# Altium project Card_reader.PrjPcb
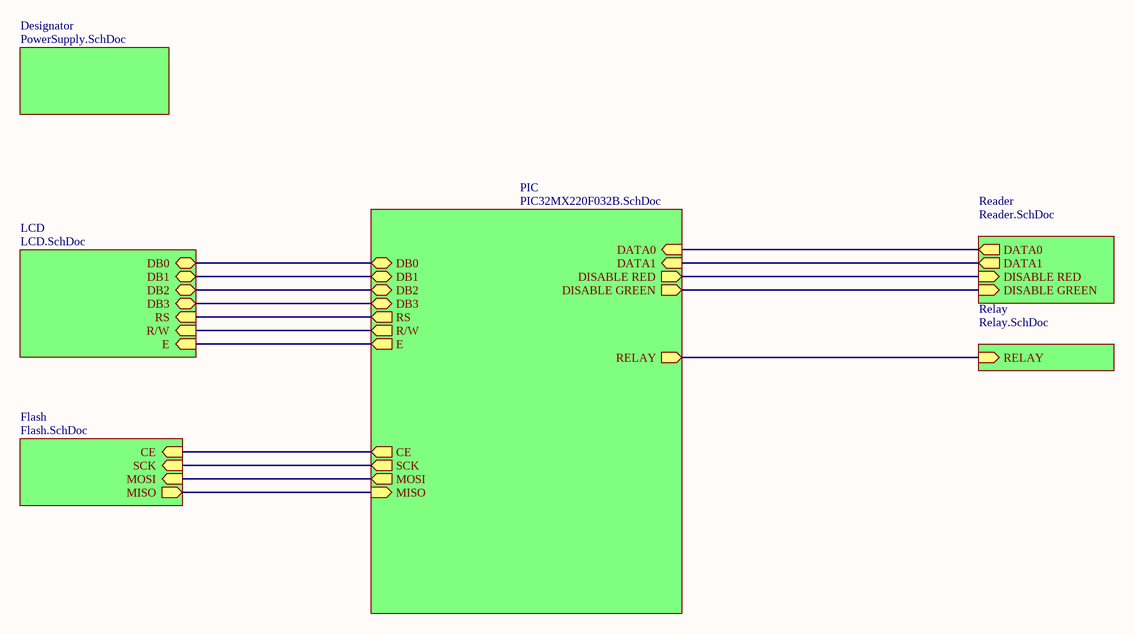
[diagram p0: Card_reader.SchDoc]
7 sheets, 36 parts. Net scope: hierarchical (ports join the sheet entries above them; power ports are global).
Board file: Card_reader2.PcbDoc
Sheets:
  Card_reader.SchDoc
    Designator = PowerSupply.SchDoc
    PIC = PIC32MX220F032B.SchDoc
    Reader = Reader.SchDoc
    Relay = Relay.SchDoc
    LCD = LCD.SchDoc
    Flash = Flash.SchDoc

## Sheet Card_reader.SchDoc
size A4

### Sub-sheets
Designator = PowerSupply.SchDoc: no entries
Flash = Flash.SchDoc: CE (in), SCK (in), MOSI (in), MISO (out)
LCD = LCD.SchDoc: DB0 (bidir), DB1 (bidir), DB2 (bidir), DB3 (bidir), RS (in), R/W (in), E (in)
PIC = PIC32MX220F032B.SchDoc: DATA0 (in), RELAY (out), DB0 (bidir), DATA1 (in), DISABLE RED (out), DISABLE GREEN (out), DB1 (bidir), DB2 (bidir), DB3 (bidir), RS (out), R/W (out), E (out), CE (out), SCK (out), MOSI (out), MISO (in)
Reader = Reader.SchDoc: DATA0 (out), DATA1 (out), DISABLE RED (in), DISABLE GREEN (in)
Relay = Relay.SchDoc: RELAY (in)

### Nets
CE: sheet PIC/CE, sheet Flash/CE
DB0: sheet PIC/DB0, sheet LCD/DB0
DB1: sheet PIC/DB1, sheet LCD/DB1
DB2: sheet PIC/DB2, sheet LCD/DB2
DB3: sheet PIC/DB3, sheet LCD/DB3
DISABLE GREEN: sheet PIC/DISABLE GREEN, sheet Reader/DISABLE GREEN
DISABLE RED: sheet PIC/DISABLE RED, sheet Reader/DISABLE RED
E: sheet PIC/E, sheet LCD/E
MISO: sheet PIC/MISO, sheet Flash/MISO
MOSI: sheet PIC/MOSI, sheet Flash/MOSI
R/W: sheet PIC/R/W, sheet LCD/R/W
RELAY: sheet PIC/RELAY, sheet Relay/RELAY
RS: sheet PIC/RS, sheet LCD/RS
SCK: sheet PIC/SCK, sheet Flash/SCK
NetR5_1: sheet PIC/DATA0, sheet Reader/DATA0
NetR7_1: sheet PIC/DATA1, sheet Reader/DATA1

### Notes on the sheet
- Title
- Size:
- Date:
- A4
- Number:
- Time:
- Revision:
- Sheet
- of
- File:

## Sheet PowerSupply.SchDoc
size A4
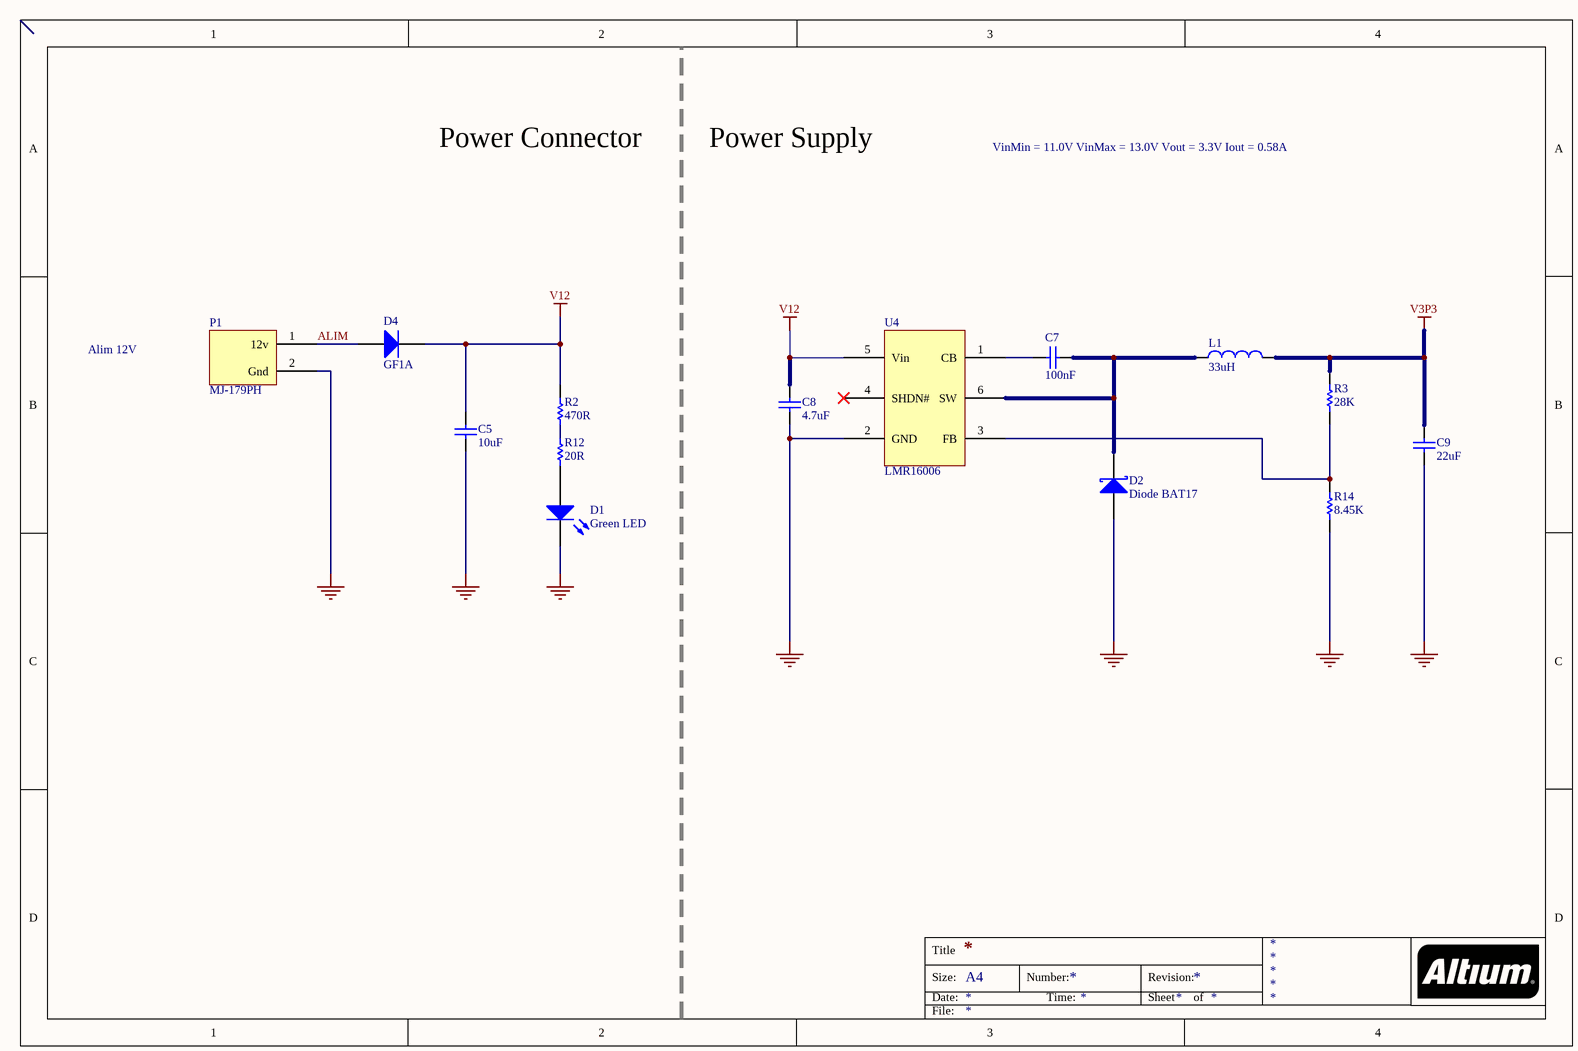
[diagram p1: PowerSupply.SchDoc]

### Parts
C5  10uF  [CAP 0603]
C7  100nF  [CAP 0603]  (no BOM)
C8  4.7uF  [CAP 0603]  (no BOM)
C9  22uF  [CAP 0603]  (no BOM)
D1  Green LED  [LED 2012]  (no BOM)
D2  Diode BAT17  [SOD-123F 12 mm]  (no BOM)
D4  GF1A  [SMA/DO-214AC_21]
L1  33uH  [IND]  (no BOM)
P1  MJ-179PH  [DC Jack]  (no BOM)
R2  470R  [RES 0603]  (no BOM)
R3  28K  [RES 0603]
R12  20R  [RES 0603]  (no BOM)
R14  8.45K  [RES 0603]
U4  LMR16006  [SOT (6)]

### Nets
GND: C5.1 C8.2 C9.2 D1.2(K) D2.1(A) P1.2(Gnd) R14.1 U4.2(GND)
V3P3: C9.1 L1.2 R3.2
V12: C5.2 C8.1 D4.2(K) R2.2 U4.5(Vin)
ALIM: D4.1(A) P1.1(12v)
NetC7_1: C7.1 U4.1(CB)
NetC7_2: C7.2 D2.3(K) L1.1 U4.6(SW)
NetD1_1: D1.1(A) R12.1
NetR2_1: R2.1 R12.2
NetR3_1: R3.1 R14.2 U4.3(FB)

Not connected (* = marked no-connect by the designer): U4 4(SHDN#)*

### Notes on the sheet
- Power Connector
- Power Supply
- VinMin = 11.0V VinMax = 13.0V Vout = 3.3V Iout = 0.58A
- Alim 12V
- Title
- Size:
- Date:
- A4
- Number:
- Time:
- Revision:
- Sheet
- of
- File:

### Library data of the parts
C5 = Cap: Capacitor; Fabricant: TDK; RefFabricant: C2012X5R0J106M/1.25; Fournisseur: Farnell; RefFournisseur: 2309029; Precision: 6,3V X5R; Published: 8-Jun-2000; LatestRevisionDate: 17-Jul-2002; LatestRevisionNote: Re-released for DXP Platform.; PackageReference: RAD-0.3; Publisher: Altium Limited; PackageDescription: Radial Cap, Thru-Hole; 2 Leads; 0.3 in Pin Spacing; Value: 10uF
C7 = Cap: Capacitor; Fournisseur: Farnell; RefFournisseur: 1740665; Fabricant: AVX; RefFabricant: 08053C104KAT2A; Published: 8-Jun-2000; LatestRevisionDate: 17-Jul-2002; LatestRevisionNote: Re-released for DXP Platform.; PackageReference: RAD-0.3; Publisher: Altium Limited; PackageDescription: Radial Cap, Thru-Hole; 2 Leads; 0.3 in Pin Spacing; Value: 100nF
C8 = Cap: Capacitor; Value: 100pF; Fabricant: MURATA; RefFabricant: GRM21BR61E475MA12L; Fournisseur: Farnell; RefFournisseur: 2362111; Published: 8-Jun-2000; LatestRevisionDate: 17-Jul-2002; LatestRevisionNote: Re-released for DXP Platform.; PackageReference: RAD-0.3; Publisher: Altium Limited; PackageDescription: Radial Cap, Thru-Hole; 2 Leads; 0.3 in Pin Spacing
C9 = Cap: Capacitor; Value: 100pF; Fournisseur: Farnell; RefFournisseur: 2666555; RefFabricant: GRM21BR60J226ME39L; Fabricant: MURATA; Published: 8-Jun-2000; LatestRevisionDate: 17-Jul-2002; LatestRevisionNote: Re-released for DXP Platform.; PackageReference: RAD-0.3; Publisher: Altium Limited; PackageDescription: Radial Cap, Thru-Hole; 2 Leads; 0.3 in Pin Spacing
D1 = LED2: Typical INFRARED GaAs LED; Fabricant: KINGBRIGHT; RefFabricant: KPT-2012SGC; Fournisseur: Farnell; RefFournisseur: 2099239; Published: 8-Jun-2000; LatestRevisionDate: 17-Jul-2002; LatestRevisionNote: Re-released for DXP Platform.; PackageVersion: Feb-2002; PackageReference: 3.2X1.6X1.1; Publisher: Altium Limited; PackageDescription: SM LED; 2 Flat Leads
D2 = Diode BAT17: Silicon RF Schottky Diode for Mixer Applications in the VHF/UHF Range; Note: Pin 2 is not connected and not drawn.; RefFournisseur: 2371113; Fournisseur: Farnell; RefFabricant: PMEG6010CEH,115; Fabricant: NEXPERIA; Published: 21-Mar-2003; LatestRevisionDate: 29-May-2009; LatestRevisionNote: IPC-7351 Footprint Added.; DatasheetVersion: Oct-1999; PackageVersion: Sep-2001; PackageReference: SOT-23; Publisher: Altium Limited; PackageDescription: 3-Pin SOT-23 Package 0.95 mm Pitch, 2.5 mm Lead Span; ComponentLink1Description: Manufacturer Link; ComponentLink1URL: http://www.infineon.com/; ComponentLink2Description: Datasheet; ComponentLink2URL: http://www.infineon.com/upload/Document/cmc_upload/documents/009/363/bat17series.pdf
D4 = Diode: Default Diode; Fabricant: VISHAY; RefFabricant: GF1A-E3/67A; Fournisseur: Farnell; RefFournisseur: 9549560; Published: 8-Jun-2000; LatestRevisionDate: 17-Jul-2002; LatestRevisionNote: Re-released for DXP Platform.; PackageVersion: Sep-1996; PackageReference: SMC; Publisher: Altium Limited; PackageDescription: DO-214-AB/SMC; 2 C-Bend Leads; Body 7.9 x 5.9 mm, inc. leads (LxW); Code_JEDEC: DO-214-AB
L1 = Inductor: Code_IEC: 1005; Value: 10mH; RefFournisseur: 2288270; Fournisseur: Farnell; RefFabricant: MSS1048-333MLC; Fabricant: COILCRAFT; Published: 8-Jun-2000; LatestRevisionDate: 29-May-2009; LatestRevisionNote: IPC-7351 Footprint Added.; PackageReference: 0402-A; Publisher: Altium Limited; PackageDescription: Chip Inductor; Code_JEITA: 0402
P1 = MJ-179PH: Connecteurs DC Jacks; Fabricant: MULTICOMP; Fournisseur: Farnell; RefFournisseur: 1737246; RefFabricant: MJ-179PH
R2 R12 = Res1: Resistor; Precision: 1%; RefFabricant: PCF0805-13-470R-B-T1; Fabricant: WELWYN; Fournisseur: Farnell; RefFournisseur: 1108854; Published: 8-Jun-2000; LatestRevisionDate: 17-Jul-2002; LatestRevisionNote: Re-released for DXP Platform.; PackageReference: AXIAL-0.3; Publisher: Altium Limited; PackageDescription: Axial Device, Thru-Hole; 2 Leads; 0.3 in Pin Spacing
  R2: Value: 470R
  R12: Value: 20R
R3 = Res1: Resistor; Value: 27K; Fabricant: VISHAY; RefFabricant: CRCW040228K0FKED; RefFournisseur: 2140888; Fournisseur: Farnell; Published: 8-Jun-2000; LatestRevisionDate: 17-Jul-2002; LatestRevisionNote: Re-released for DXP Platform.; PackageReference: AXIAL-0.3; Publisher: Altium Limited; PackageDescription: Axial Device, Thru-Hole; 2 Leads; 0.3 in Pin Spacing
R14 = Res1: Resistor; Value: 150R; Fournisseur: Farnell; RefFournisseur: 2140852; Fabricant: VISHAY; RefFabricant: CRCW04028K45FKED; Published: 8-Jun-2000; LatestRevisionDate: 17-Jul-2002; LatestRevisionNote: Re-released for DXP Platform.; PackageReference: AXIAL-0.3; Publisher: Altium Limited; PackageDescription: Axial Device, Thru-Hole; 2 Leads; 0.3 in Pin Spacing
U4 = LMR16006: Régulateurs à découpage DC/DC ajustables; Fabricant: Texas Instruments; RefFabricant: LMR16006YDDC; Fournisseur: Farnell; RefFournisseur: 2455134

## Sheet PIC32MX220F032B.SchDoc
size A4
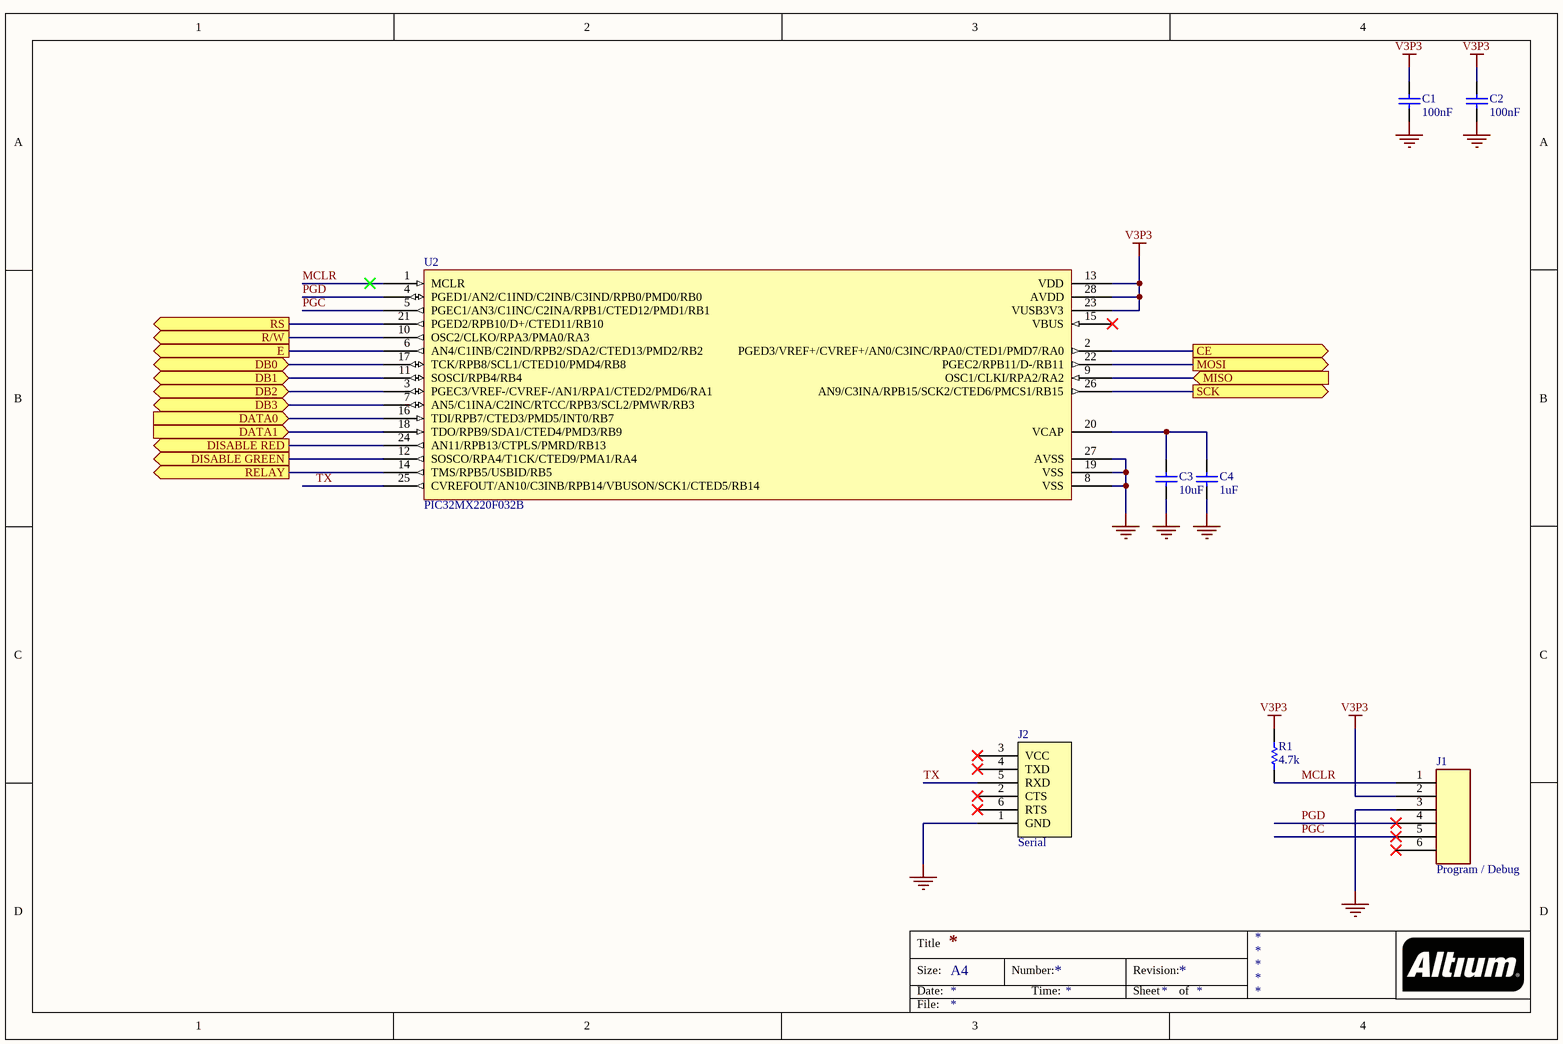
[diagram p2: PIC32MX220F032B.SchDoc]

### Parts
C1  100nF  [CAP 0603]  (no BOM)
C2  100nF  [CAP 0603]  (no BOM)
C3  10uF  [CAP 0603]  (no BOM)
C4  1uF  [CAP 0603]  (no BOM)
J1  Program / Debug  [RJ12_90]  (no BOM)
J2  Serial  [Header 6 pin]
R1  4.7k  [RES 0603]  (no BOM)
U2  PIC32MX220F032B  [SOIC (28)]

### Ports
CE (out), DATA0 (in), DATA1 (in), DB0 (bidir), DB1 (bidir), DB2 (bidir), DB3 (bidir), DISABLE GREEN (out), DISABLE RED (out), E (out), MISO (in), MOSI (out), R/W (out), RELAY (out), RS (out), SCK (out)

### Nets
GND: C1.1 C2.1 C3.1 C4.2 J1.3 J2.1(GND) U2.8(VSS) U2.19(VSS) U2.27(AVSS)
V3P3: C1.2 C2.2 J1.2 R1.2 U2.13(VDD) U2.23(VUSB3V3) U2.28(AVDD)
CE: U2.2(PGED3/VREF+/CVREF+/AN0/C3INC/RPA0/CTED1/PMD7/RA0) ; port CE
DB0: U2.17(TCK/RPB8/SCL1/CTED10/PMD4/RB8) ; port DB0
DB1: U2.11(SOSCI/RPB4/RB4) ; port DB1
DB2: U2.3(PGEC3/VREF-/CVREF-/AN1/RPA1/CTED2/PMD6/RA1) ; port DB2
DB3: U2.7(AN5/C1INA/C2INC/RTCC/RPB3/SCL2/PMWR/RB3) ; port DB3
DISABLE GREEN: U2.12(SOSCO/RPA4/T1CK/CTED9/PMA1/RA4) ; port DISABLE GREEN
DISABLE RED: U2.24(AN11/RPB13/CTPLS/PMRD/RB13) ; port DISABLE RED
E: U2.6(AN4/C1INB/C2IND/RPB2/SDA2/CTED13/PMD2/RB2) ; port E
MCLR: J1.1 R1.1 U2.1(MCLR)
MISO: U2.9(OSC1/CLKI/RPA2/RA2) ; port MISO
MOSI: U2.22(PGEC2/RPB11/D-/RB11) ; port MOSI
PGC: J1.5 U2.5(PGEC1/AN3/C1INC/C2INA/RPB1/CTED12/PMD1/RB1)
PGD: J1.4 U2.4(PGED1/AN2/C1IND/C2INB/C3IND/RPB0/PMD0/RB0)
R/W: U2.10(OSC2/CLKO/RPA3/PMA0/RA3) ; port R/W
RELAY: U2.14(TMS/RPB5/USBID/RB5) ; port RELAY
RS: U2.21(PGED2/RPB10/D+/CTED11/RB10) ; port RS
SCK: U2.26(AN9/C3INA/RPB15/SCK2/CTED6/PMCS1/RB15) ; port SCK
TX: J2.5(RXD) U2.25(CVREFOUT/AN10/C3INB/RPB14/VBUSON/SCK1/CTED5/RB14)
NetC3_2: C3.2 C4.1 U2.20(VCAP)
NetR5_1: U2.16(TDI/RPB7/CTED3/PMD5/INT0/RB7) ; port DATA0
NetR7_1: U2.18(TDO/RPB9/SDA1/CTED4/PMD3/RB9) ; port DATA1

Not connected (* = marked no-connect by the designer): J1 6(69)*; J2 2(CTS)* 3(VCC)* 4(TXD)* 6(RTS)*; U2 15(VBUS)*

### Notes on the sheet
- Title
- Size:
- Date:
- A4
- Number:
- Time:
- Revision:
- Sheet
- of
- File:

### Library data of the parts
C1 C2 = Cap: Capacitor; Precision: 50V X5R; Fournisseur: Farnell; RefFabricant: 0805B104K500CT; RefFournisseur: 2496944; Fabricant: WALSIN; Published: 8-Jun-2000; LatestRevisionDate: 17-Jul-2002; LatestRevisionNote: Re-released for DXP Platform.; PackageReference: RAD-0.3; Publisher: Altium Limited; PackageDescription: Radial Cap, Thru-Hole; 2 Leads; 0.3 in Pin Spacing; Value: 100nF; Type: Capacitor
C3 = Cap: as C5 on sheet PowerSupply; Published: 8-Jun-2000; LatestRevisionDate: 17-Jul-2002; LatestRevisionNote: Re-released for DXP Platform.; PackageReference: RAD-0.3; Publisher: Altium Limited; PackageDescription: Radial Cap, Thru-Hole; 2 Leads; 0.3 in Pin Spacing; Value: 10uF
C4 = Cap: Capacitor; Precision: 6,3V X5R; Published: 8-Jun-2000; LatestRevisionDate: 17-Jul-2002; LatestRevisionNote: Re-released for DXP Platform.; PackageReference: RAD-0.3; Publisher: Altium Limited; PackageDescription: Radial Cap, Thru-Hole; 2 Leads; 0.3 in Pin Spacing; Value: 1uF; Fournisseur: *; RefFournisseur: *; Fabricant: *; RefFabricant: *
J1 = Debug: RJ11; Fabricant: Tyco; RefFabricant: 1-215876-3; Fournisseur: Farnell; RefFournisseur: 1773039
J2 = Serial: Header 6 pin
R1 = Res1: Resistor; Value: 1K; Precision: 1%; Fournisseur: Farnell; RefFournisseur: 2502463; Fabricant: WALSIN; RefFabricant: WR06X4701FTL; Published: 8-Jun-2000; LatestRevisionDate: 17-Jul-2002; LatestRevisionNote: Re-released for DXP Platform.; PackageReference: AXIAL-0.3; Publisher: Altium Limited; PackageDescription: Axial Device, Thru-Hole; 2 Leads; 0.3 in Pin Spacing
U2 = PIC32MX220F032B: Fabricant: MICROCHIP; Fournisseur: Farnell

## Sheet Reader.SchDoc
size A4
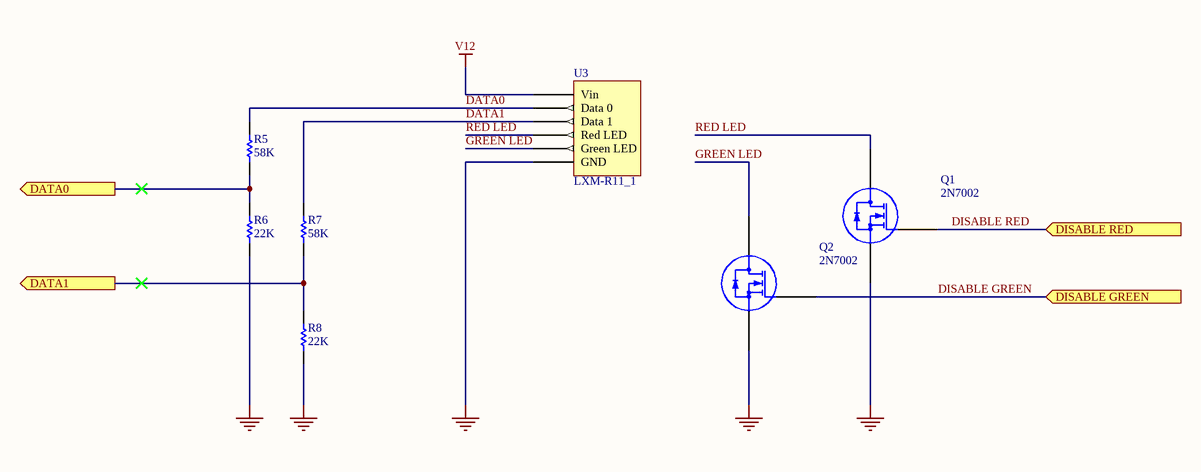
[diagram p3: Reader.SchDoc]

### Parts
Q1  2N7002  [TO-236AB]
Q2  2N7002  [TO-236AB]
R5  58K  [RES 0603]  (no BOM)
R6  22K  [RES 0603]  (no BOM)
R7  58K  [RES 0603]  (no BOM)
R8  22K  [RES 0603]  (no BOM)
U3  LXM-R11_1  [Bornier 6 pin]

### Ports
DATA0 (out), DATA1 (out), DISABLE GREEN (in), DISABLE RED (in)

### Nets
GND: Q1.2(S) Q2.2(S) R6.1 R8.1 U3.6(GND)
V12: U3.1(Vin)
DATA0: R5.2 U3.2(Data_0)
DATA1: R7.2 U3.3(Data_1)
DISABLE GREEN: Q2.1(G) ; port DISABLE GREEN
DISABLE RED: Q1.1(G) ; port DISABLE RED
GREEN LED: Q2.3(D) U3.5(Green_LED)
RED LED: Q1.3(D) U3.4(Red_LED)
NetR5_1: R5.1 R6.2 ; port DATA0
NetR7_1: R7.1 R8.2 ; port DATA1

### Notes on the sheet
- Title
- Size:
- Date:
- A4
- Number:
- Time:
- Revision:
- Sheet
- of
- File:

### Library data of the parts
Q1 Q2 = 2N7002: Transistor MOSFET, Canal N, 300 mA, 60 V, 2.8 ohm, 10 V, 2 V; Fabricant: NEXPERIA; Fournisseur: Farnell; RefFabricant: 2N7002,215; RefFournisseur: 1510761
R5 R7 = Res1: Resistor; Value: 100K; Fournisseur: Farnell; RefFournisseur: 1108917; Fabricant: WELWYN; RefFabricant: PCF0805-13-100K-B-T1; Published: 8-Jun-2000; LatestRevisionDate: 17-Jul-2002; LatestRevisionNote: Re-released for DXP Platform.; PackageReference: AXIAL-0.3; Publisher: Altium Limited; PackageDescription: Axial Device, Thru-Hole; 2 Leads; 0.3 in Pin Spacing
R6 R8 = Res1: Resistor; Value: 1K; Fournisseur: Farnell; RefFournisseur: 1353268; Fabricant: WELWYN; RefFabricant: PCF0805R-38K3BT1; Published: 8-Jun-2000; LatestRevisionDate: 17-Jul-2002; LatestRevisionNote: Re-released for DXP Platform.; PackageReference: AXIAL-0.3; Publisher: Altium Limited; PackageDescription: Axial Device, Thru-Hole; 2 Leads; 0.3 in Pin Spacing
U3 = LXM-R11_1: Lecteur RFid; Fabricant: STid; RefFabricant: LXM-R11; Fournisseur: *; RefFournisseur: *

## Sheet Relay.SchDoc
size A4
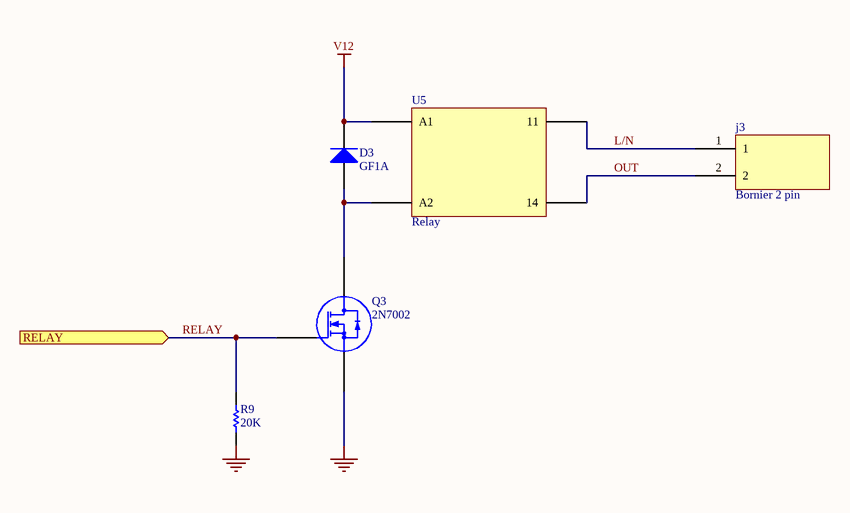
[diagram p4: Relay.SchDoc]

### Parts
D3  GF1A  [SMA/DO-214AC_21]
j3  Bornier 2 pin  [Bornier 2 pin]
Q3  2N7002  [TO-236AB]
R9  20K  [RES 0603]  (no BOM)
U5  Relay  [Relay]

### Ports
RELAY (in)

### Nets
GND: Q3.2(S) R9.2
V12: D3.2(K) U5.A1
L/N: j3.1 U5.11
OUT: j3.2 U5.14
RELAY: Q3.1(G) R9.1 ; port RELAY
NetD3_1: D3.1(A) Q3.3(D) U5.A2

### Notes on the sheet
- Title
- Size:
- Date:
- A4
- Number:
- Time:
- Revision:
- Sheet
- of
- File:

### Library data of the parts
D3 = Diode: as D4 on sheet PowerSupply; Published: 8-Jun-2000; LatestRevisionDate: 17-Jul-2002; LatestRevisionNote: Re-released for DXP Platform.; PackageVersion: Sep-1996; PackageReference: SMC; Publisher: Altium Limited; PackageDescription: DO-214-AB/SMC; 2 C-Bend Leads; Body 7.9 x 5.9 mm, inc. leads (LxW); Code_JEDEC: DO-214-AB
j3 = Header 2 pin: RefFournisseur: 3041359; Fabricant: PHOENIX CONTACT; Fournisseur: Farnell; RefFabricant: 1725656
Q3 = 2N7002: as Q1 on sheet Reader
R9 = Res1: as R5 on sheet Reader; Published: 8-Jun-2000; LatestRevisionDate: 17-Jul-2002; LatestRevisionNote: Re-released for DXP Platform.; PackageReference: AXIAL-0.3; Publisher: Altium Limited; PackageDescription: Axial Device, Thru-Hole; 2 Leads; 0.3 in Pin Spacing
U5 = Relay: Relais de puissance; Fabricant: TE CONNECTIVITY / OEG; RefFabricant: PCFN-112H2MS; Fournisseur: Farnell; RefFournisseur: 2504686

## Sheet LCD.SchDoc
size A4
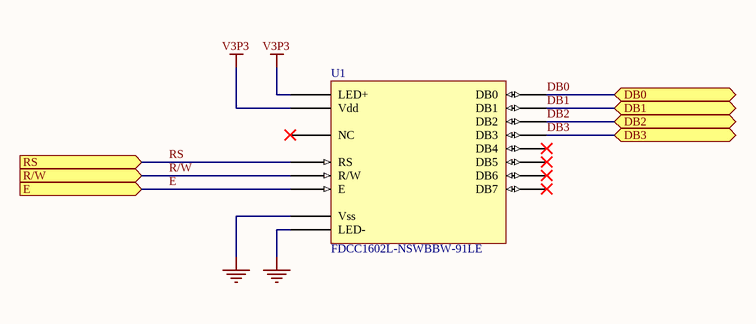
[diagram p5: LCD.SchDoc]

### Parts
U1  FDCC1602L-NSWBBW-91LE  [LCD (Only header)]

### Ports
DB0 (bidir), DB1 (bidir), DB2 (bidir), DB3 (bidir), E (in), R/W (in), RS (in)

### Nets
GND: U1.1(Vss) U1.16(LED-)
V3P3: U1.2(Vdd) U1.15(LED+)
DB0: U1.7(DB0) ; port DB0
DB1: U1.8(DB1) ; port DB1
DB2: U1.9(DB2) ; port DB2
DB3: U1.10(DB3) ; port DB3
E: U1.6(E) ; port E
R/W: U1.5(R/W) ; port R/W
RS: U1.4(RS) ; port RS

Not connected (* = marked no-connect by the designer): U1 3(NC)* 11(DB4)* 12(DB5)* 13(DB6)* 14(DB7)*

### Notes on the sheet
- Title
- Size:
- Date:
- A4
- Number:
- Time:
- Revision:
- Sheet
- of
- File:

### Library data of the parts
U1 = FDCC1602L-NSWBBW-91LE: Fournisseur: Farnell; RefFournisseur: 1847941; Fabricant: FORDATA; RefFabricant: FDCC1602L-NSWBBW-91LE

## Sheet Flash.SchDoc
size A4
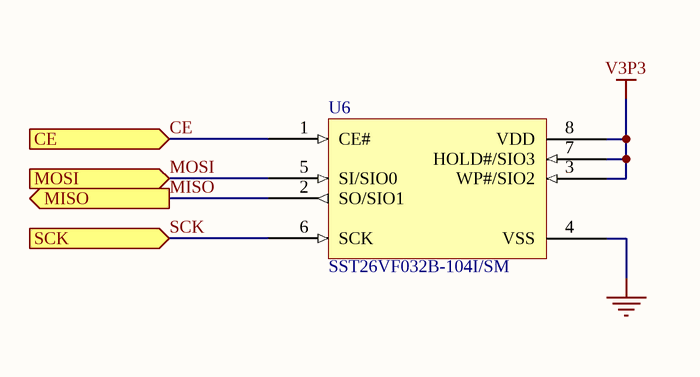
[diagram p6: Flash.SchDoc]

### Parts
U6  SST26VF032B-104I/SM  [SOIC 8]

### Ports
CE (in), MISO (out), MOSI (in), SCK (in)

### Nets
GND: U6.4(VSS)
V3P3: U6.3(WP#/SIO2) U6.7(HOLD#/SIO3) U6.8(VDD)
CE: U6.1(CE#) ; port CE
MISO: U6.2(SO/SIO1) ; port MISO
MOSI: U6.5(SI/SIO0) ; port MOSI
SCK: U6.6(SCK) ; port SCK

### Notes on the sheet
- Title
- Size:
- Date:
- A4
- Number:
- Time:
- Revision:
- Sheet
- of
- File:

### Library data of the parts
U6 = SST26VF032B-104I/SM: Fabricant: MICROCHIP; Fournisseur: Farnell; RefFournisseur: 2471177; RefFabricant: SST26VF032B-104I/SM

## Nets that join several sheets
GND: PowerSupply (8 pins), PIC32MX220F032B (9 pins), Reader (5 pins), Relay (Q3.2 R9.2), LCD (U1.1 U1.16), Flash (U6.4)
V3P3: PowerSupply (C9.1 L1.2 R3.2), PIC32MX220F032B (7 pins), LCD (U1.2 U1.15), Flash (U6.3 U6.7 U6.8)
V12: PowerSupply (5 pins), Reader (U3.1), Relay (D3.2 U5.A1)
CE: PIC32MX220F032B (U2.2), Flash (U6.1)
DB0: PIC32MX220F032B (U2.17), LCD (U1.7)
DB1: PIC32MX220F032B (U2.11), LCD (U1.8)
DB2: PIC32MX220F032B (U2.3), LCD (U1.9)
DB3: PIC32MX220F032B (U2.7), LCD (U1.10)
DISABLE GREEN: PIC32MX220F032B (U2.12), Reader (Q2.1)
DISABLE RED: PIC32MX220F032B (U2.24), Reader (Q1.1)
E: PIC32MX220F032B (U2.6), LCD (U1.6)
MISO: PIC32MX220F032B (U2.9), Flash (U6.2)
MOSI: PIC32MX220F032B (U2.22), Flash (U6.5)
NetR5_1: PIC32MX220F032B (U2.16), Reader (R5.1 R6.2)
NetR7_1: PIC32MX220F032B (U2.18), Reader (R7.1 R8.2)
R/W: PIC32MX220F032B (U2.10), LCD (U1.5)
RELAY: PIC32MX220F032B (U2.14), Relay (Q3.1 R9.1)
RS: PIC32MX220F032B (U2.21), LCD (U1.4)
SCK: PIC32MX220F032B (U2.26), Flash (U6.6)